# EAGLE design brd-relays2 (EAGLE 6.5.0)
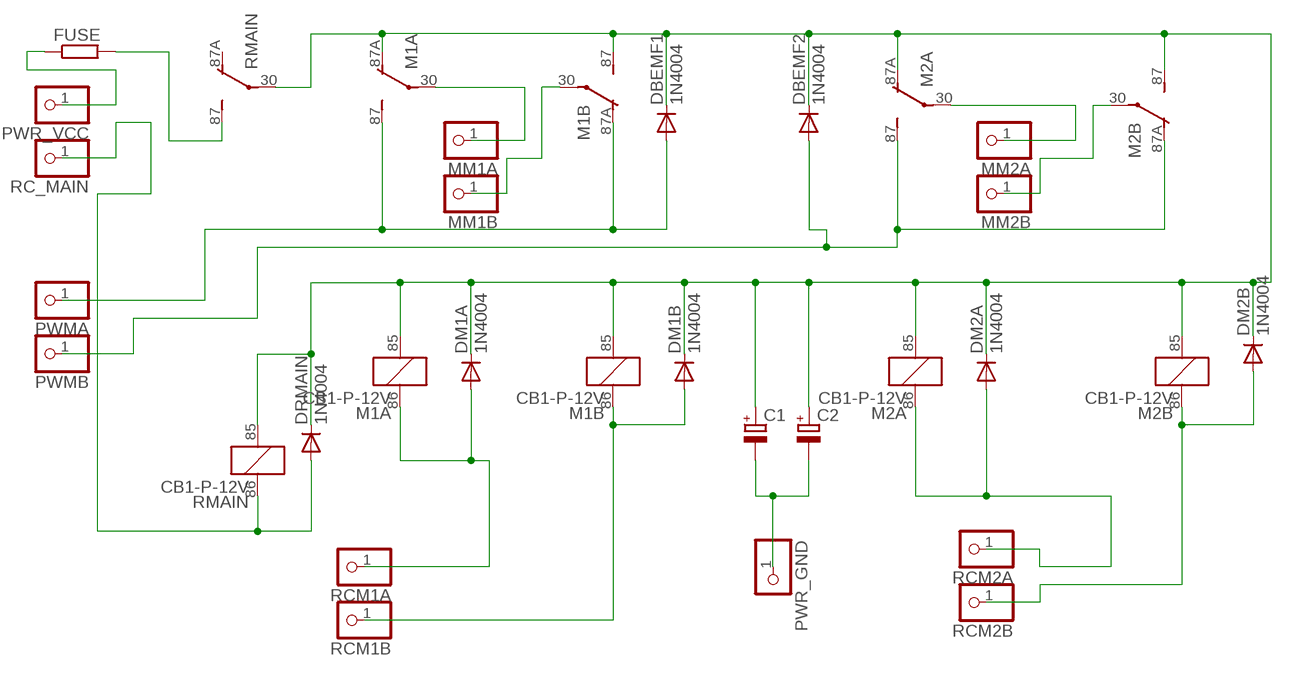
[diagram p0: schematic, sheet 1]

## Parts
C1  CPOL-EUE5-13  [E5-13]
C2  CPOL-EUE5-13  [E5-13]
DBEMF1  1N4004  [DO41-10]
DBEMF2  1N4004  [DO41-10]
DM1A  1N4004  [DO41-10]
DM1B  1N4004  [DO41-10]
DM2A  1N4004  [DO41-10]
DM2B  1N4004  [DO41-10]
DRMAIN  1N4004  [DO41-10]
FUSE  R-EU_0207/10  [FUSE_PACK1]
M1A  CB1-P-12V  [CB1]
M1B  CB1-P-12V  [CB1]
M2A  CB1-P-12V  [CB1]
M2B  CB1-P-12V  [CB1]
MM1A  PINHD-1X1  [1X01]
MM1B  PINHD-1X1  [1X01]
MM2A  PINHD-1X1  [1X01]
MM2B  PINHD-1X1  [1X01]
PWMA  PINHD-1X1  [1X01]
PWMB  PINHD-1X1  [1X01]
PWR_GND  PINHD-1X1  [1X01]
PWR_VCC  PINHD-1X1  [1X01]
RC_MAIN  PINHD-1X1  [1X01]
RCM1A  PINHD-1X1  [1X01]
RCM1B  PINHD-1X1  [1X01]
RCM2A  PINHD-1X1  [1X01]
RCM2B  PINHD-1X1  [1X01]
RMAIN  CB1-P-12V  [CB1]

## Nets
N$1: C1.+ C2.+ DBEMF1.C DBEMF2.C DM1A.C DM1B.C DM2A.C DM2B.C DRMAIN.C M1A.85 M1A.87A(2:O) M1B.85 M1B.87(2:S) M2A.85 M2A.87A(2:O) M2B.85 M2B.87(2:S) RMAIN.30(2:P) RMAIN.85
N$2: M1A.30(2:P) MM1A.1
N$3: M1B.30(2:P) MM1B.1
N$4: FUSE.2 RMAIN.87(2:S)
N$5: DBEMF1.A M1A.87(2:S) M1B.87A(2:O) PWMA.1
N$6: C1.- C2.- PWR_GND.1
N$7: M2A.30(2:P) MM2A.1
N$8: M2B.30(2:P) MM2B.1
N$9: DM1A.A M1A.86 RCM1A.1
N$10: DM1B.A M1B.86 RCM1B.1
N$11: DM2A.A M2A.86 RCM2A.1
N$12: DM2B.A M2B.86 RCM2B.1
N$13: DBEMF2.A M2A.87(2:S) M2B.87A(2:O) PWMB.1
N$14: DRMAIN.A RC_MAIN.1 RMAIN.86
N$16: FUSE.1 PWR_VCC.1
Unconnected: RMAIN.87A(2:O)

## Library data of the parts
C1 C2 = rcl:CPOL-EU: POLARIZED CAPACITOR, European symbol
DBEMF1 DBEMF2 DM1A DM1B DM2A DM2B DRMAIN = diode:1N4004: DIODE general purpose rectifier, 1 A
FUSE = dbg-misc:R-EU_: RESISTOR, European symbol
M1A M1B M2A M2B RMAIN = dbg-misc:CB1*: HIGH POWER AUTOMOTIVE RELAY Form C NAiS Source: http://www.mew-europe.com/.. en_ds_61202_0000.pdf; MF: AROMAT/ MATSUSHITA; MPN: CB1-P-12V; OC_FARNELL: unknown; OC_NEWARK: 52F9201
MM1A MM1B MM2A MM2B PWMA PWMB PWR_GND PWR_VCC RC_MAIN RCM1A RCM1B RCM2A RCM2B = dbg-misc:PINHD-1X1: PIN HEADER

## Board
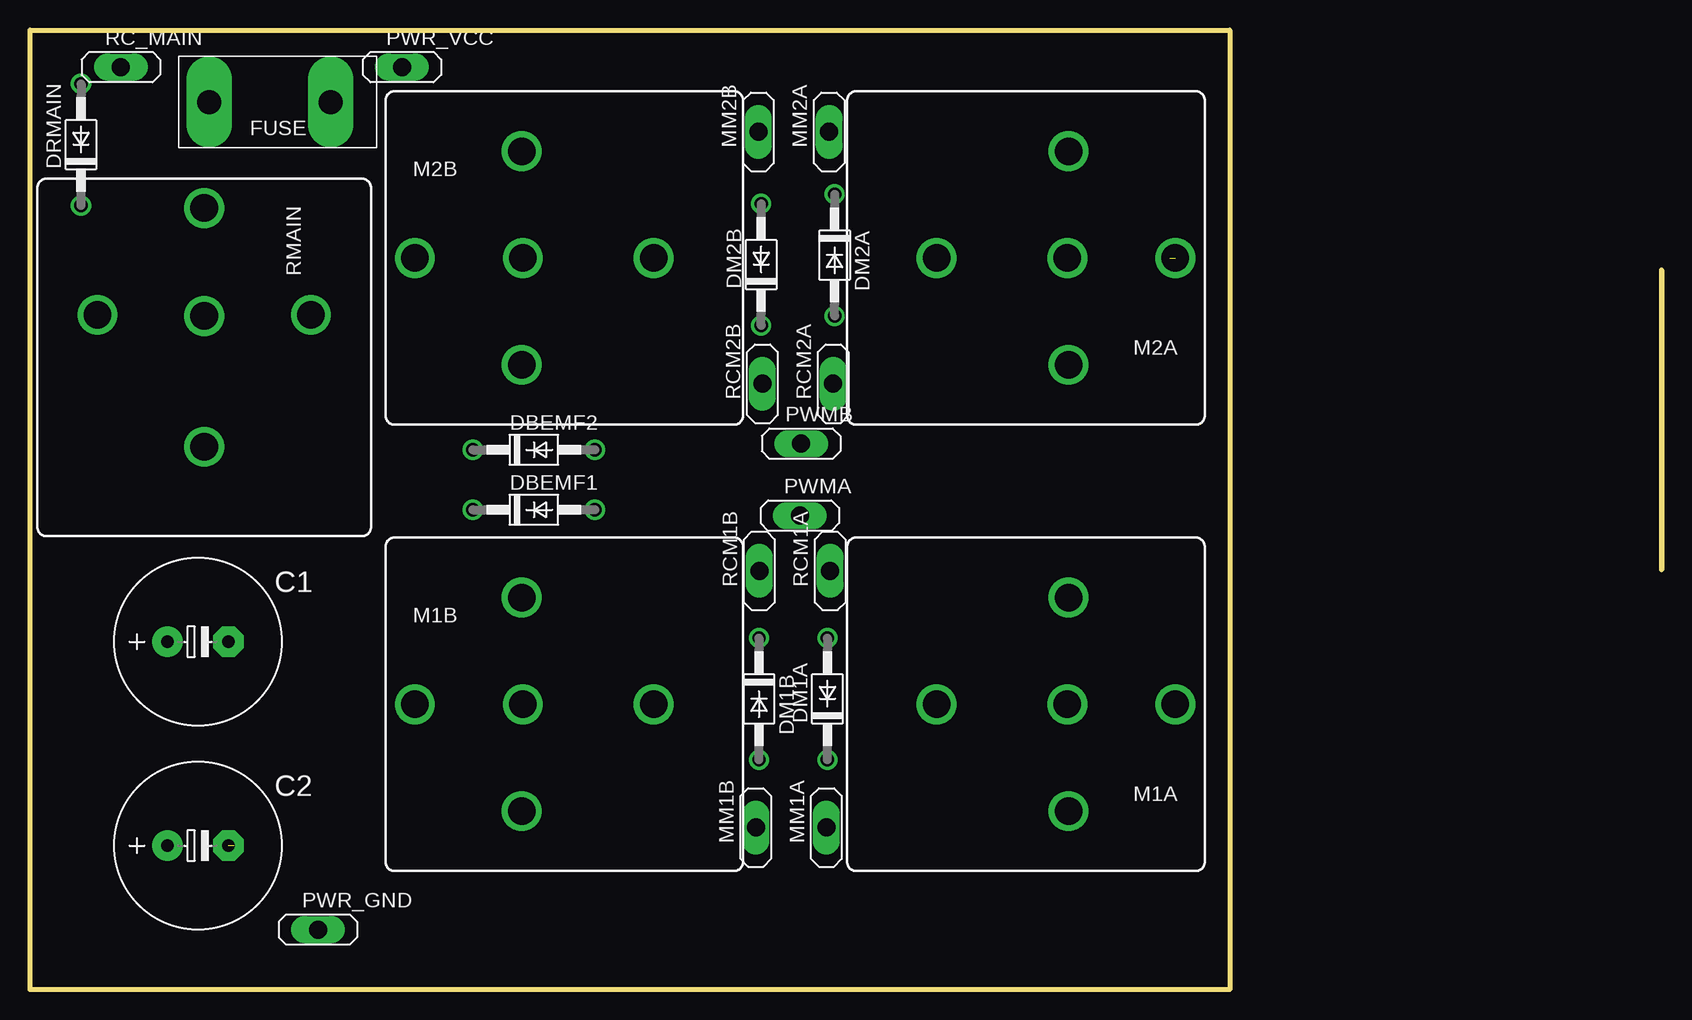
[diagram p1: board, top side]
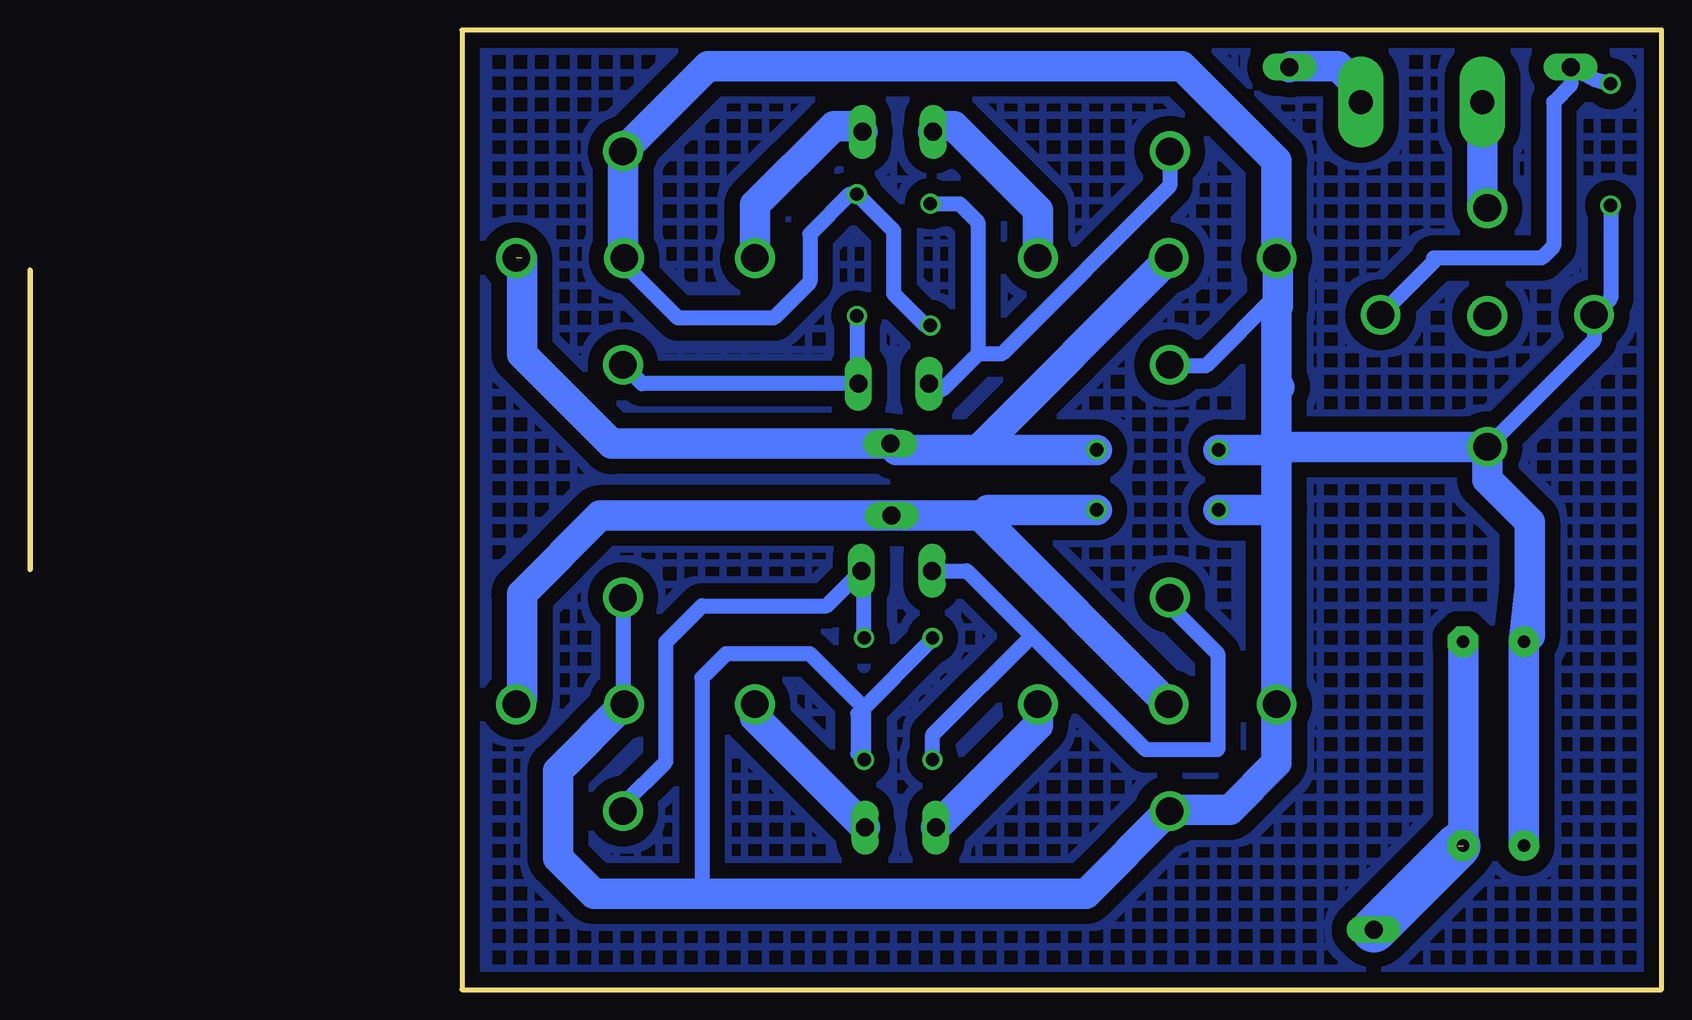
[diagram p2: board, bottom side, seen from below]

Size 136 x 80 mm. Coordinates in mm from the lower left corner, seen from the top.
Outline: 0,80 100,80 100,0 0,0 0,80
Copper layers (1*16): Top 0.035mm / dielectric 1.5mm / Bottom 0.035mm
Design rules "default": minimum track width 10mil, minimum drill 24mil, track to track 8mil, track to pad 8mil, pad to pad 8mil, via to via 8mil, smd to smd 8mil, copper to edge 40mil, drill to drill 8mil, minimum pad ring 10mil, minimum via ring 8mil, stop-mask expansion 4mil, vias tented up to drill 0mil, thermal gap 10mil

### Footprints (pad centres in the part's own frame; a part is rotated, then mirrored left to right if it is on the bottom)
E5-13 = drill 1.016 pad 2.54: + -2.54,0 | drill 1.016 pad 2.54 octagon: - 2.54,0
DO41-10 = drill 1.118: A 5.08,0; C -5.08,0
FUSE_PACK1 = drill 2 pad 3.81 long: 1 -5.08,0; 2 5.08,0
CB1 = drill 2.3: 30 9.95,-3; 85 -1.05,-11.9; 86 -1.05,5.9; 87 -9.95,-3; 87A -0.95,-3
1X01 = drill 1.5 long: 1 0,0

### Placement (x,y rotation side)
C1  14,29 0 top
C2  14,12 0 top
DBEMF1  42,40 0 top
DBEMF2  42,45 0 top
DM1A  66.47,24.23 90 top
DM1B  60.77,24.23 270 top
DM2A  67.07,61.23 270 top
DM2B  60.95,60.44 90 top
DRMAIN  4.25,70.44 90 top
FUSE  20,74 180 top
M1A  85.52,20.78 180 top
M1B  42.04,26.78 0 top
M2A  85.52,57.99 180 top
M2B  42.04,63.99 0 top
MM1A  66.39,13.52 90 top
MM1B  60.5,13.52 90 top
MM2A  66.61,71.52 90 top
MM2B  60.72,71.52 90 top
PWMA  64.17,39.52 0 top
PWMB  64.28,45.52 0 top
PWR_GND  24,5 0 top
PWR_VCC  31.01,76.9 0 top
RC_MAIN  7.58,76.9 0 top
RCM1A  66.69,34.9 90 top
RCM1B  60.8,34.9 90 top
RCM2A  66.95,50.52 90 top
RCM2B  61.06,50.52 90 top
RMAIN  17.52,55.2 270 top

### Tracks (layer width: path | path; a pad name or v marks a point on that pad's centre or on a via)
N$1
  Bottom 1.27: M2B.87 32.09,57.91 38,52 40.9,52 M2B.85 | DM2B.C 61.36,55.36 64,58 64,63.24 DM2A.C 67.69,66.31 71,63 71,59 74,56 82,56 86,60 86,60.52 M2A.87A | M1A.85 86.57,23.88 M1A.87A | DM1B.C 60.77,29.23 67,23 67,19.68 DM1A.C 66.47,23.47 71,28 78,28 80,26 80,9 79,8 | DRMAIN.C 4.25,57.62 RMAIN.85 5.62,54.15 RMAIN.30
  Bottom 2.54: M2A.87A 86.57,61.09 M2A.85 79.46,77 40,77 32.09,69.09 M2B.87 32,60.9 32,57 32.09,56.91 32.09,50 | 32.09,40 M1B.87 32.09,18.91 36,15 40.87,15 M1B.85 41.12,14.88 48,8 79,8 89,8 92,11 92,18.25 M1A.87A | 32.09,40 32.09,45 | 32.09,45 32.09,50 | 31.84,50.25 32.09,50 | 11,33.46 C1.+ | C1.+ C2.+ | DBEMF2.C 32.09,45 | DBEMF1.C 32.09,40 | 32.09,45 31.84,45.25 RMAIN.30 14.52,42.52 11,39 11,29.46 C1.+
N$2
  Bottom 2.54: M1A.30 75.57,22.7 MM1A.1
N$3
  Bottom 2.54: M1B.30 51.99,22.03 MM1B.1
N$4
  Bottom 2.54: FUSE.2 14.92,65.55 RMAIN.87
N$5
  Bottom 2.54: M1A.87 95,24.25 95,33 88.48,39.52 PWMA.1 56.83,39.52 56.16,38.84 | 56.16,38.84 M1B.87A | DBEMF1.A 56.16,40 56.16,38.84
N$6  (1 unrouted)
  Bottom 2.54: C1.- C2.-
  Bottom 3.81: 17,12 PWR_GND.1
N$7
  Bottom 2.54: M2A.30 75.57,65.43 69,72 67.09,72 MM2A.1
N$8
  Bottom 2.54: M2B.30 51.99,64.99 59,72 60.24,72 MM2B.1
N$9
  Bottom 1.27: M1A.86 86.57,15.43 83,19 83,29 80,32 69.59,32 RCM1A.1 66.47,34.68 DM1A.A
N$10
  Bottom 1.27: M1B.86 40.99,31.99 37,28 37,20 43,20 52.5,29.5 | 52.5,29.5 57.9,34.9 RCM1B.1 | DM1B.A 60.77,21.23 52.5,29.5
N$11
  Bottom 1.27: M2A.86 85,50.52 RCM2A.1 67.07,50.64 DM2A.A
N$12
  Bottom 1.27: DM2B.A 58.52,65.52 57,64 57,53 | 57,53 60,50 60.54,50 RCM2B.1 | M2B.86 40.99,67.01 55,53 57,53
N$13  (1 unrouted)
  Bottom 2.54: M2B.87A 41.09,60.91 57,45 | 57,45 58,45 63.76,45 PWMB.1 87.52,45.52 95,53 95,61 | DBEMF2.A 57,45
N$14
  Bottom 1.27: DRMAIN.A 5.63,75.9 RC_MAIN.1 7.58,75.42 9,74 9,62 10,61 19,61 19,60.67 RMAIN.86
N$15
  pour Bottom (isolate 1.27, hatched): 1,79 99,79 99,1 1,1
N$16
  Bottom 2.54: FUSE.1 25.08,75.08 27,77 30.91,77 PWR_VCC.1